# EAGLE design Stellaris Guru PCBv1 (EAGLE 5.07)
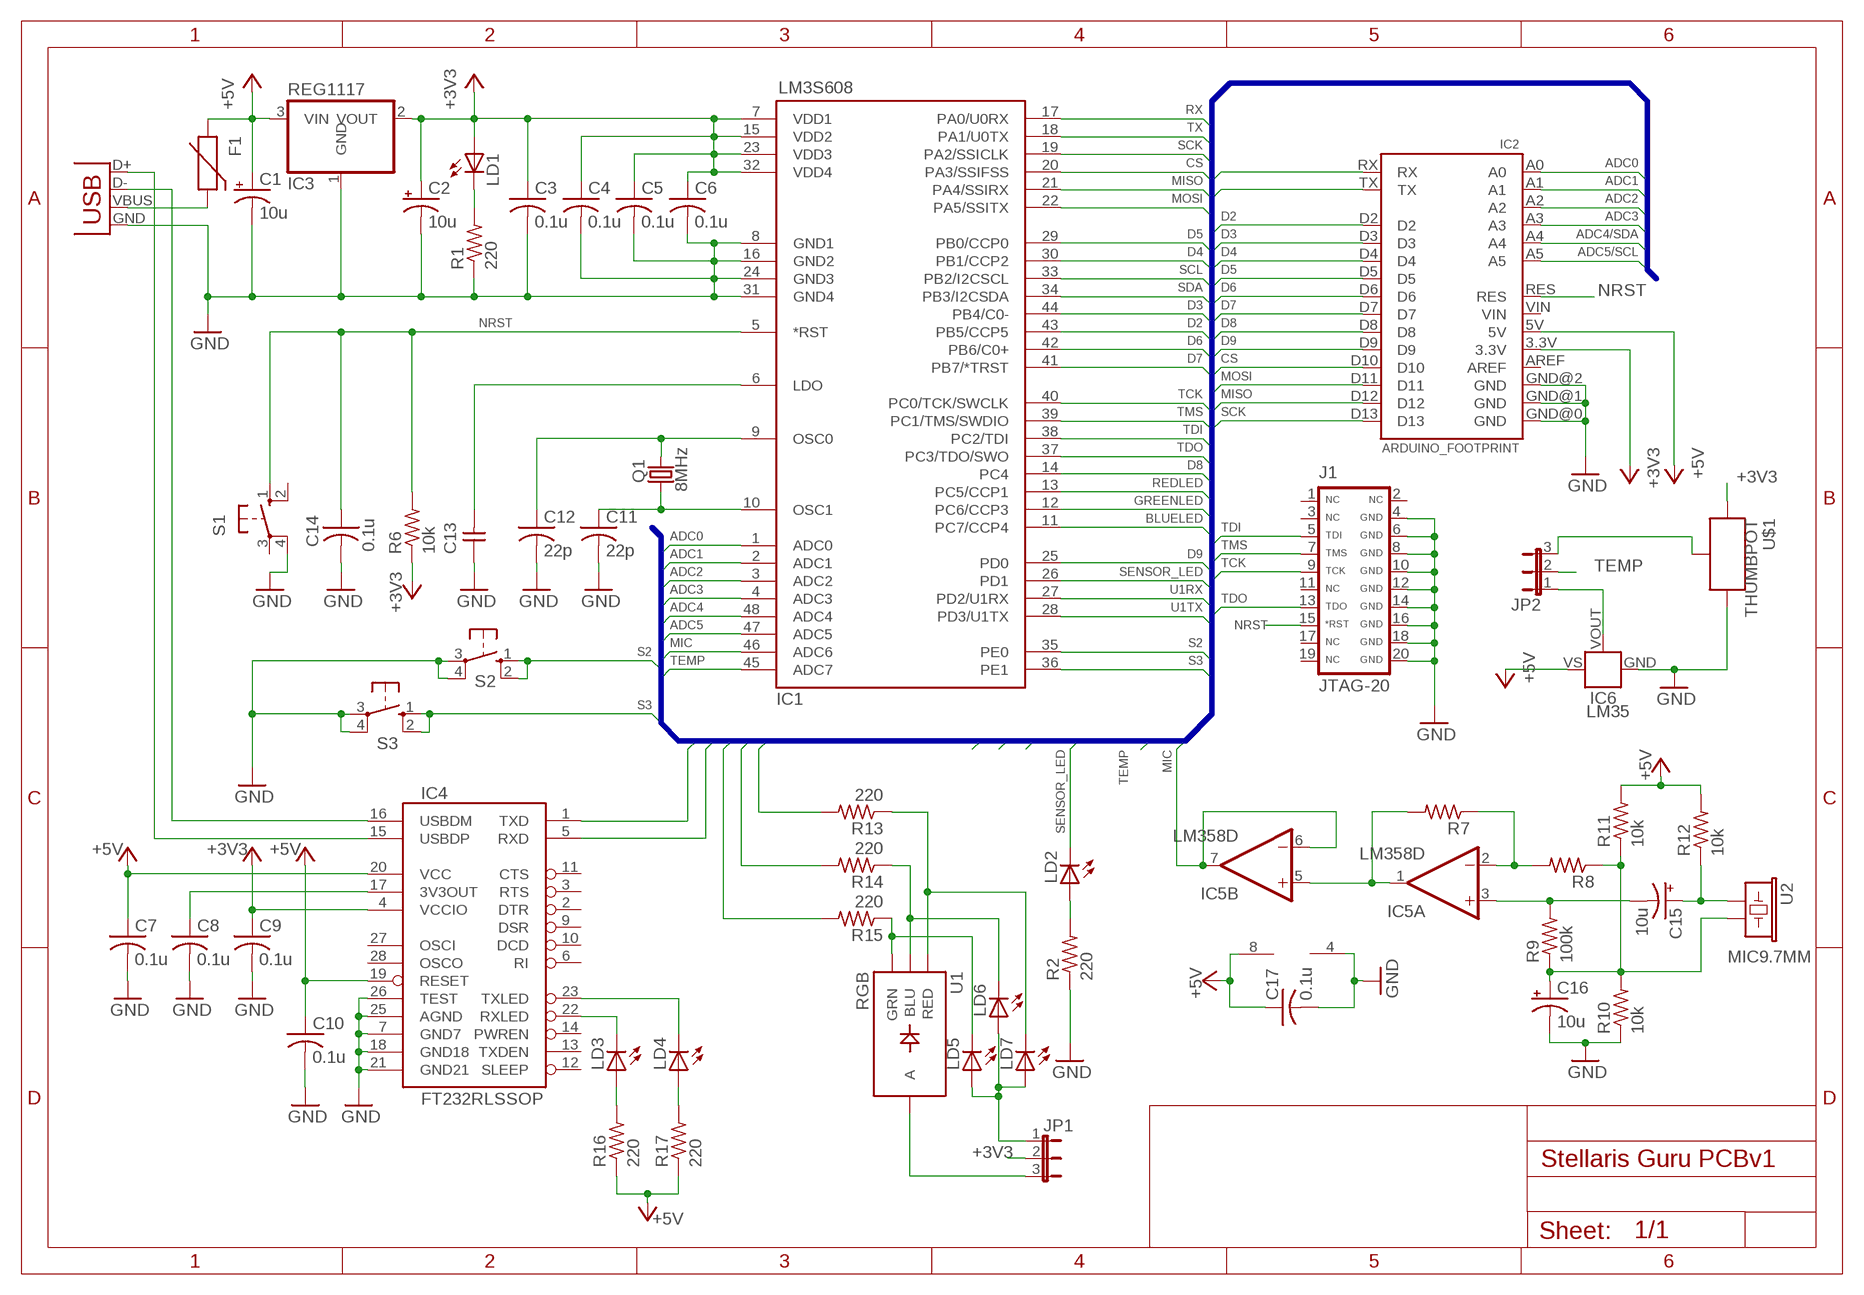
[diagram p0: schematic, sheet 1]

## Parts
C1  10u  CAP_POL_16V  [B/3528-21R]
C2  10u  CAP_POL_16V  [B/3528-21R]
C3  0.1u  CAP0805  [C0805]
C4  0.1u  CAP0805  [C0805]
C5  0.1u  CAP0805  [C0805]
C6  0.1u  CAP0805  [C0805]
C7  0.1u  CAP0805  [C0805]
C8  0.1u  CAP0805  [C0805]
C9  0.1u  CAP0805  [C0805]
C10  0.1u  CAP0805  [C0805]
C11  22p  CAP0805  [C0805]
C12  22p  CAP0805  [C0805]
C13  UNPOLARIZED_CAPACITOR1206  [1206]
C14  0.1u  CAP0805  [C0805]
C15  10u  CAP_POL_16V  [B/3528-21R]
C16  10u  CAP_POL_16V  [B/3528-21R]
C17  0.1u  CAP0805  [C0805]
F1  PTCSMD  [PTC-1206]
IC1  LM3S608  [LQFP48]
IC2  ARDUINO_FOOTPRINT  [ARDUINO_FOOTPRINT]
IC3  REG1117  [SOT223]
IC4  FT232RLSSOP  [SSOP28DB]
IC5  LM358D  [SO08]
IC6  LM35  LM35TO-92  [TO92]
J1  JTAG-20  [JTAG-20]
JP1  JP2W  [JP2W]
JP2  JP2W  [JP2W]
LD1  LED0805  [CHIPLED_0805]
LD2  LED0805  [CHIPLED_0805]
LD3  LED0805  [CHIPLED_0805]
LD4  LED0805  [CHIPLED_0805]
LD5  LED0805  [CHIPLED_0805]
LD6  LED0805  [CHIPLED_0805]
LD7  LED0805  [CHIPLED_0805]
Q1  8MHz  CRYSTALHC49US  [HC49US]
R1  220  RESISTOR0805  [R0805]
R2  220  RESISTOR0805  [R0805]
R6  10k  RESISTOR0805  [R0805]
R7  RESISTOR0805  [R0805]
R8  RESISTOR0805  [R0805]
R9  100k  RESISTOR0805  [R0805]
R10  10k  RESISTOR0805  [R0805]
R11  10k  RESISTOR0805  [R0805]
R12  10k  RESISTOR0805  [R0805]
R13  220  RESISTOR0805  [R0805]
R14  220  RESISTOR0805  [R0805]
R15  220  RESISTOR0805  [R0805]
R16  220  RESISTOR0805  [R0805]
R17  220  RESISTOR0805  [R0805]
S1  10-XX  [B3F-10XX]
S2  10-XX  [B3F-10XX]
S3  10-XX  [B3F-10XX]
U1  RGB  LED-TRICOLOR  [LED-TRICOLOR-SMD]
U2  MIC9.7MM  [MIC-9.7MM]
U$1  THUMBPOT  [THUMBPOT]
X1  USBSMD  [USB-MINIB]

## Nets
+3V3 [+3V3]: C2.+ C3.1 C4.1 C5.1 C6.1 C9.1 IC1.7(VDD1) IC1.15(VDD2) IC1.23(VDD3) IC1.32(VDD4) IC2.3.3V IC3.2(VOUT) IC4.4(VCCIO) JP1.2 LD1.A R6.1 U$1.1(E)
+5V [power]: C1.+ C7.1 C10.1 C17.1 F1.1 IC2.5V IC3.3(VIN) IC4.19(RESET) IC4.20(VCC) IC5.8(P:V+) IC6.VS R11.2 R12.2 R16.1 R17.1
ADC0: IC1.1(ADC0) IC2.A0
ADC1: IC1.2(ADC1) IC2.A1
ADC2: IC1.3(ADC2) IC2.A2
ADC3: IC1.4(ADC3) IC2.A3
ADC4: IC1.34(PB3/I2CSDA) IC1.48(ADC4) IC2.A4
ADC5: IC1.33(PB2/I2CSCL) IC1.47(ADC5) IC2.A5
BLUELED: IC1.11(PC7/CCP4) R15.2
CS: IC1.20(PA3/SSIFSS) IC2.D10
D2: IC1.43(PB5/CCP5) IC2.D2
D3: IC1.44(PB4/C0-) IC2.D3
D4: IC1.30(PB1/CCP2) IC2.D4
D5: IC1.29(PB0/CCP0) IC2.D5
D6: IC1.42(PB6/C0+) IC2.D6
D7: IC1.41(PB7/*TRST) IC2.D7
D8: IC1.14(PC4) IC2.D8
D9: IC1.25(PD0) IC2.D9
GND [GND]: C1.- C2.- C3.2 C4.2 C5.2 C6.2 C7.2 C8.2 C9.2 C10.2 C11.2 C12.2 C13.1 C14.2 C16.- C17.2 IC1.8(GND1) IC1.16(GND2) IC1.24(GND3) IC1.31(GND4) IC2.GND@0(GND) IC2.GND@1(GND) IC2.GND@2(GND) IC3.1(GND) IC4.7(GND7) IC4.18(GND18) IC4.21(GND21) IC4.25(AGND) IC4.26(TEST) IC5.4(P:V-) IC6.GND J1.4(GND) J1.6(GND) J1.8(GND) J1.10(GND) J1.12(GND) J1.14(GND) J1.16(GND) J1.18(GND) J1.20(GND) R1.1 R2.1 R10.1 S1.4(P1) S2.3(P) S2.4(P1) S3.3(P) S3.4(P1) U$1.3(A) X1.GND
GREENLED: IC1.12(PC6/CCP3) R14.2
MIC: IC1.46(ADC6) IC5.6(B:-IN) IC5.7(B:OUT)
MISO: IC1.21(PA4/SSIRX) IC2.D12
MOSI: IC1.22(PA5/SSITX) IC2.D11
N$1: IC4.22(RXLED) LD3.C
N$2: IC4.16(USBDM) X1.D-
N$3: LD1.C R1.2
N$4: IC4.15(USBDP) X1.D+
N$5: C8.1 IC4.17(3V3OUT)
N$6: IC4.23(TXLED) LD4.C
N$7: LD4.A R17.2
N$8: LD3.A R16.2
N$11: C12.1 IC1.9(OSC0) Q1.2
N$12: C11.1 IC1.10(OSC1) Q1.1
N$13: C13.2 IC1.6(LDO)
N$16: LD2.A R2.2
N$18: IC5.1(A:OUT) IC5.5(B:+IN) R7.2
N$19: IC5.2(A:-IN) R7.1 R8.2
N$20: C15.+ R12.1 U2.1
N$21: C16.+ R8.1 R9.1 R10.2 R11.1 U2.2
N$22: C15.- IC5.3(A:+IN) R9.2
N$23: LD7.C R13.1 U1.R(RED)
N$25: LD6.C R14.1 U1.B(BLU)
N$27: LD5.C R15.1 U1.G(GRN)
N$28 [power]: F1.2 X1.VBUS
N$33: IC6.VOUT JP2.1
N$34: JP2.3 U$1.2(S)
N$35 [power]: JP1.1 LD5.A LD6.A LD7.A
N$36 [power]: JP1.3 U1.A
NRST: C14.1 IC1.5(*RST) IC2.RES J1.15(RST) R6.2 S1.1(S)
REDLED: IC1.13(PC5/CCP1) R13.2
RX: IC1.17(PA0/U0RX) IC4.1(TXD)
S2: IC1.35(PE0) S2.1(S) S2.2(S1)
S3: IC1.36(PE1) S3.1(S) S3.2(S1)
SCK: IC1.19(PA2/SSICLK) IC2.D13
SENSOR_LED: IC1.26(PD1) LD2.C
TCK: IC1.40(PC0/TCK/SWCLK) J1.9(TCK)
TDI: IC1.38(PC2/TDI) J1.5(TDI)
TDO: IC1.37(PC3/TDO/SWO) J1.13(TDO)
TEMP: IC1.45(ADC7) JP2.2
TMS: IC1.39(PC1/TMS/SWDIO) J1.7(TMS)
TX: IC1.18(PA1/U0TX) IC4.5(RXD)
U1RX: IC1.27(PD2/U1RX) IC2.RX
U1TX: IC1.28(PD3/U1TX) IC2.TX
Unconnected: IC2.AREF IC2.VIN IC4.2(DTR) IC4.3(RTS) IC4.6(RI) IC4.9(DSR) IC4.10(DCD) IC4.11(CTS) IC4.12(SLEEP) IC4.13(TXDEN) IC4.14(PWREN) IC4.27(OSCI) IC4.28(OSCO) J1.1(VREF) J1.2(VTAR) J1.3(NTRST) J1.11(RTCK) J1.17(OBGRQ) J1.19(OBGACK) S1.2(S1) S1.3(P)

## Buses
ADC0,ADC1,ADC2,ADC3,ADC4,ADC5,MISO,MOSI,CS,SCK,RX,TX,D2,D3,D4,D5,D6,D7,D8,D9,U1RX,U1TX,TCK,TMS,TDI,TDO,SENSOR_LED,REDLED,GREENLED,BLUELED,S2,S3,MIC,TEMP

## Notes on the sheet
- ADC4/SDA
- ADC5/SCL
- SCL
- SDA

## Library data of the parts
C1 C2 C15 C16 = CEDTv50:CAP_POL
C3-C12 C14 C17 = CEDTv56:CAP
C13 = ng:UNPOLARIZED_CAPACITOR: unpolarized_capacitor
F1 = CEDTv56:PTC: Resettable Fuse PTC Resettable Fuse. Spark Fun Electronics SKU : COM-08357
IC1 = CEDTv50:LM3S608
IC2 = CEDTv50:ARDUINO_FOOTPRINT: Standard footprint of the Arduino Board.
IC3 = CEDTv50:REG1117: 800mA and 1A Low Dropout (LDO) Positive Regulator 1.8V, 2.5V, 2.85V, 3.3V, 5V, and Adj
IC4 = CEDTv56:FT232RL: USB UART FT232RL 4th Generation USB UART (USB <-> Serial) Controller. Spark Fun Electronics SKU : COM-00650
IC5 = linear:LM358: OP AMP also LM158; LM258; LM2904 Source: http://cache.national.com/ds/LM/LM158.pdf
IC6 = CEDTv50:LM35TO-92
J1 = CEDTv50:JTAG-20: JTAG 20-Pin Programming/Debug Connector
JP1 JP2 = jumper:JP2W: JUMPER
LD1-LD7 = CEDTv56:LED
Q1 = CEDTv56:CRYSTAL: Crystals Various standard crystals. Proven footprints. Spark Fun Electronics SKU : COM-00534
R1 R2 R6-R17 = CEDTv56:RESISTOR
S1-S3 = CEDTv50:10-XX: OMRON SWITCH
U1 = SparkFun:LED-TRICOLOR: Tri-Color LED SMD Proven layout and schematic for triple color LED in SMD package - common anode. Spark Fun Electronics SKU : COM-07844
U2 = CEDTv56:MIC: Microphone Omni-directional electret microphone. 9.7mm standard diameter.
U$1 = CEDTv52:THUMBPOT
X1 = CEDTv56:USB: USB Connectors USB-B-PTH is fully proven SKU : PRT-00139 USB-miniB is fully proven SKU : PRT-00587 USB-A-PCB is untested. USB-A-H is throughly reviewed, but untested. Spark Fun Electronics SKU : PRT-00437 USB-B-SMT is throughly reviewed, but untested. Needs silkscreen touching up. USB-A-S has not been used/tested USB-MB-H has not been used/tested

## Net classes
0 default: width 0.241 mm, clearance 0.127 mm
1 power: width 0.508 mm
2 +3V3: width 0.508 mm
3 GND: width 0.508 mm

## Board
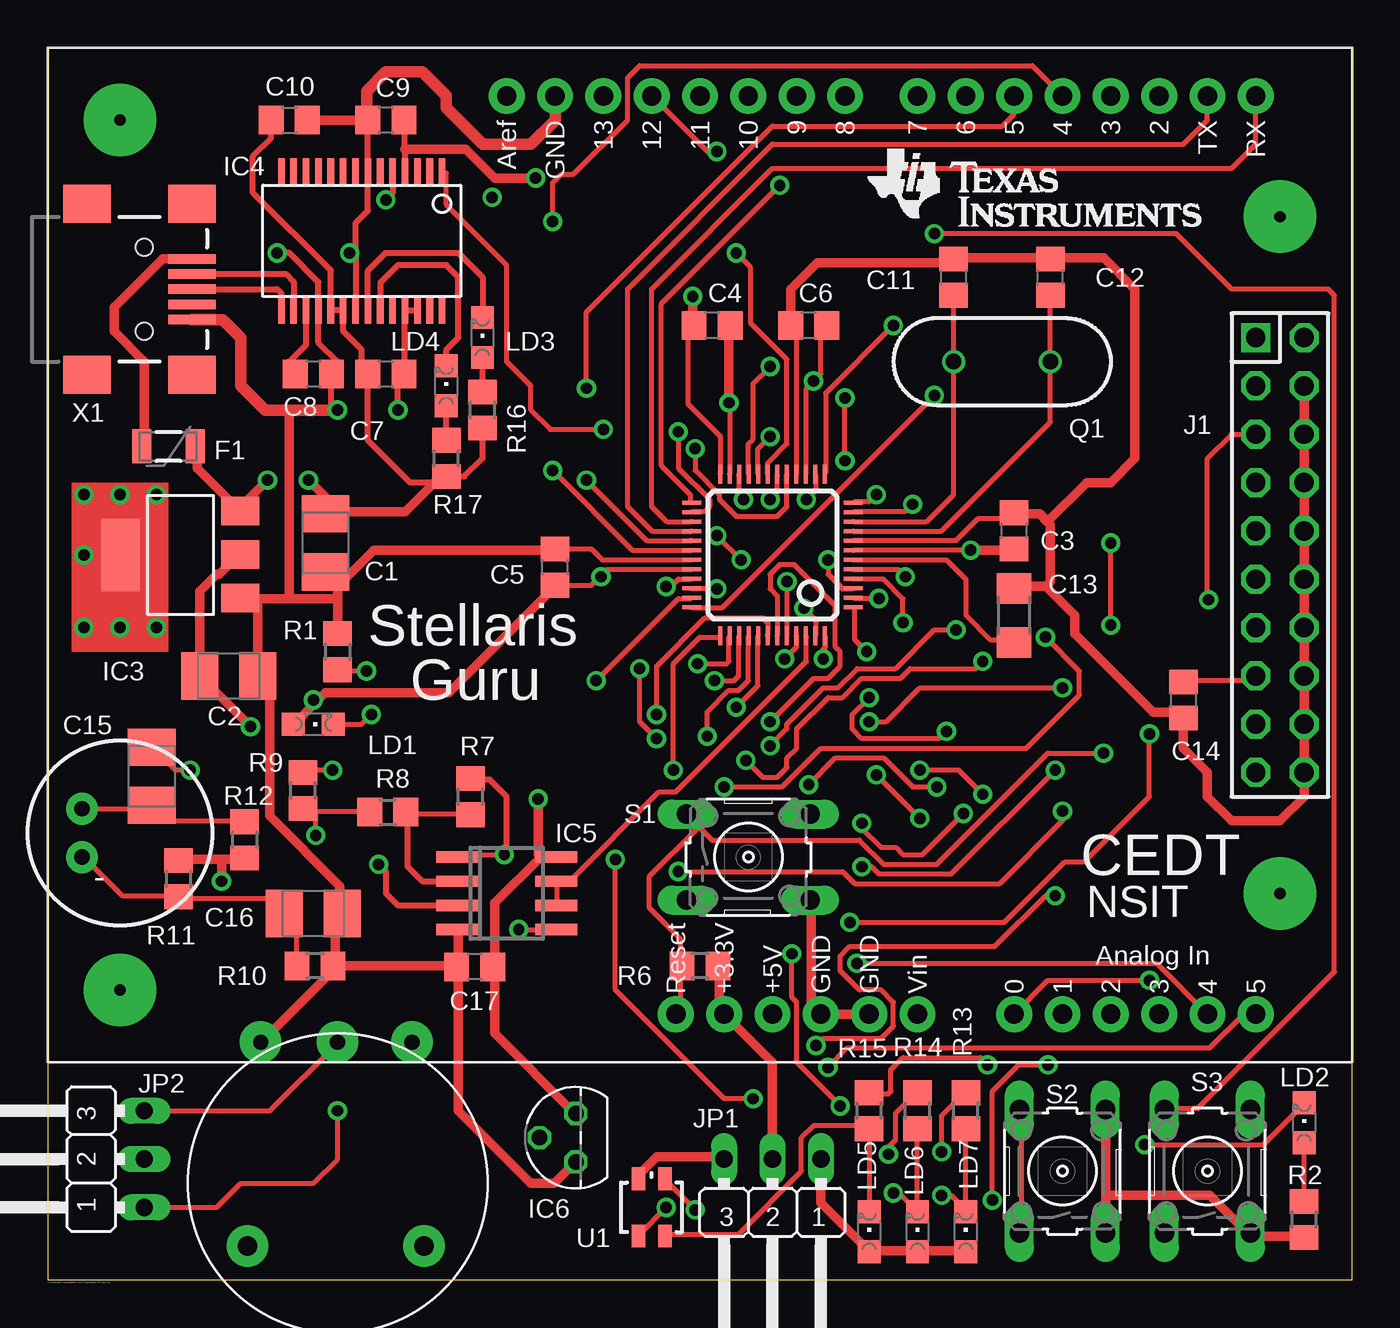
[diagram p1: board, top side]
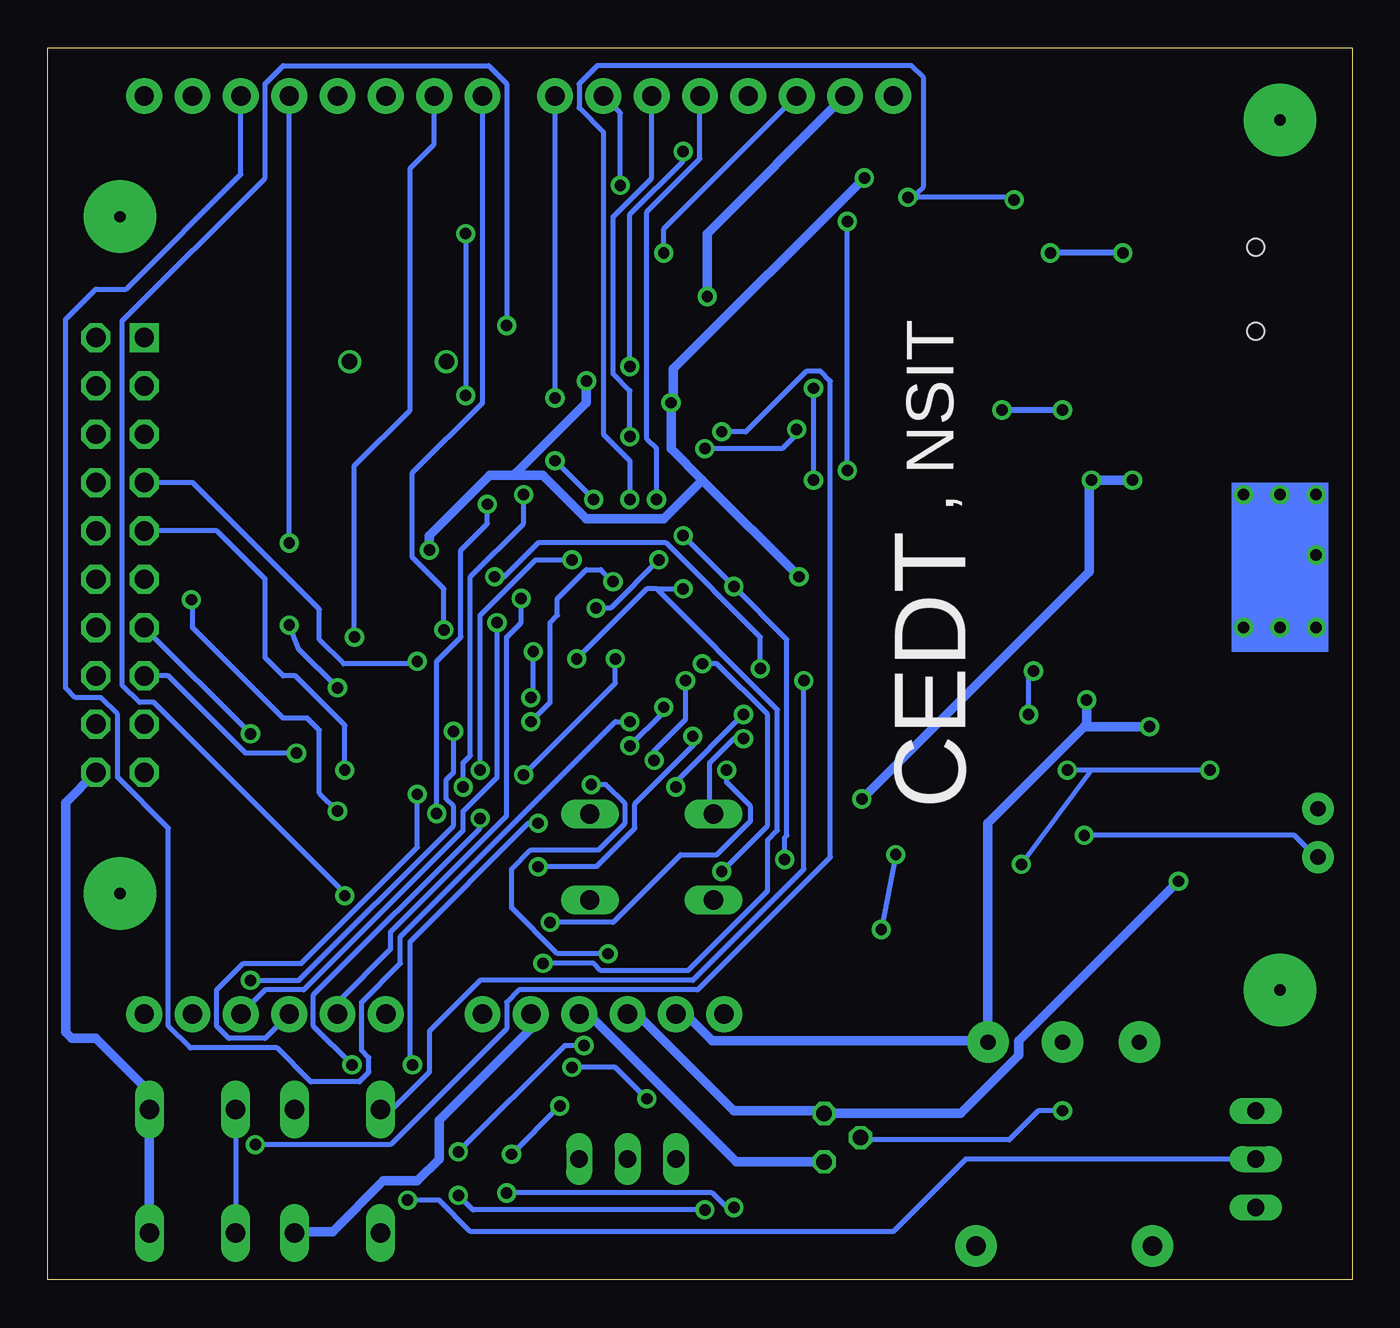
[diagram p2: board, bottom side, seen from below]

Size 68.58 x 64.77 mm. Coordinates in mm from the lower left corner, seen from the top.
Outline: 68.56,0 0,0 0,64.77 68.58,64.77 68.58,0
Copper layers (1*16): Top 0.035mm / dielectric 1.5mm / Bottom 0.035mm
Design rules "default *": minimum track width 10mil, minimum drill 0.6mm, track to track 8mil, track to pad 8mil, pad to pad 8mil, via to via 8mil, smd to smd 8mil, copper to edge 40mil, drill to drill 10mil, minimum pad ring 8mil, minimum via ring 8mil, stop-mask expansion 4mil, vias tented up to drill 0mil, thermal gap 10mil

### Footprints (pad centres in the part's own frame; a part is rotated, then mirrored left to right if it is on the bottom)
B/3528-21R = smd 1.95 x 2.5: + 1.525,0; - -1.525,0
C0805 = smd 1.3 x 1.5: 1 -0.95,0; 2 0.95,0
1206 = smd 1.6 x 1.803: 1 -1.422,0; 2 1.422,0
PTC-1206 = smd 1 x 1.8: 1 -1.4,0; 2 1.4,0
LQFP48 = smd 1 x 0.2: 1 -4.25,2.75; 2 -4.25,2.25; 3 -4.25,1.75; 4 -4.25,1.25; 5 -4.25,0.75; 6 -4.25,0.25; 7 -4.25,-0.25; 8 -4.25,-0.75; 9 -4.25,-1.25; 10 -4.25,-1.75; 11 -4.25,-2.25; 12 -4.25,-2.75; 25 4.25,-2.75; 26 4.25,-2.25; 27 4.25,-1.75; 28 4.25,-1.25; 29 4.25,-0.75; 30 4.25,-0.25; 31 4.25,0.25; 32 4.25,0.75; 33 4.25,1.25; 34 4.25,1.75; 35 4.25,2.25; 36 4.25,2.75 | smd 0.2 x 1: 13 -2.75,-4.25; 14 -2.25,-4.25; 15 -1.75,-4.25; 16 -1.25,-4.25; 17 -0.75,-4.25; 18 -0.25,-4.25; 19 0.25,-4.25; 20 0.75,-4.25; 21 1.25,-4.25; 22 1.75,-4.25; 23 2.25,-4.25; 24 2.75,-4.25; 37 2.75,4.25; 38 2.25,4.25; 39 1.75,4.25; 40 1.25,4.25; 41 0.75,4.25; 42 0.25,4.25; 43 -0.25,4.25; 44 -0.75,4.25; 45 -1.25,4.25; 46 -1.75,4.25; 47 -2.25,4.25; 48 -2.75,4.25
ARDUINO_FOOTPRINT = drill 1.016 pad 1.88 round: 3.3V 35.56,2.54; 5V 38.1,2.54; A0 50.8,2.54; A1 53.34,2.54; A2 55.88,2.54; A3 58.42,2.54; A4 60.96,2.54; A5 63.5,2.54; AREF 24.13,50.8; D2 58.42,50.8; D3 55.88,50.8; D4 53.34,50.8; D5 50.8,50.8; D6 48.26,50.8; D7 45.72,50.8; D8 41.91,50.8; D9 39.37,50.8; D10 36.83,50.8; D11 34.29,50.8; D12 31.75,50.8; D13 29.21,50.8; GND@0 40.64,2.54; GND@1 43.18,2.54; GND@2 26.67,50.8; RES 33.02,2.54; RX 63.5,50.8; TX 60.96,50.8; VIN 45.72,2.54
SOT223 = smd 1.499 x 2.007: 1 -2.261,-3.15; 2 0.025,-3.15; 3 2.311,-3.15 | smd 3.81 x 2.007: 4 0,3.15
SSOP28DB = smd 0.348 x 1.397: 1 -4.225,-3.656; 2 -3.575,-3.656; 3 -2.925,-3.656; 4 -2.275,-3.656; 5 -1.625,-3.656; 6 -0.975,-3.656; 7 -0.325,-3.656; 8 0.325,-3.656; 9 0.975,-3.656; 10 1.625,-3.656; 11 2.275,-3.656; 12 2.925,-3.656; 13 3.575,-3.656; 14 4.225,-3.656; 15 4.225,3.656; 16 3.575,3.656; 17 2.925,3.656; 18 2.275,3.656; 19 1.625,3.656; 20 0.975,3.656; 21 0.325,3.656; 22 -0.325,3.656; 23 -0.975,3.656; 24 -1.625,3.656; 25 -2.275,3.656; 26 -2.925,3.656; 27 -3.575,3.656; 28 -4.225,3.656
SO08 = smd 0.6 x 2.2: 1 -1.905,-2.6; 2 -0.635,-2.6; 3 0.635,-2.6; 4 1.905,-2.6; 5 1.905,2.6; 6 0.635,2.6; 7 -0.635,2.6; 8 -1.905,2.6
TO92 = drill 0.813 octagon: GND -1.27,0; VOUT 0,1.905; VS 1.27,0
JTAG-20 = drill 1.016 square: 1 -11.43,-1.27 | drill 1.016 octagon: 2 -11.43,1.27; 3 -8.89,-1.27; 4 -8.89,1.27; 5 -6.35,-1.27; 6 -6.35,1.27; 7 -3.81,-1.27; 8 -3.81,1.27; 9 -1.27,-1.27; 10 -1.27,1.27; 11 1.27,-1.27; 12 1.27,1.27; 13 3.81,-1.27; 14 3.81,1.27; 15 6.35,-1.27; 16 6.35,1.27; 17 8.89,-1.27; 18 8.89,1.27; 19 11.43,-1.27; 20 11.43,1.27
JP2W = drill 0.914 long: 1 -2.54,-1.27; 2 0,-1.27; 3 2.54,-1.27
CHIPLED_0805 = smd 1.2 x 1.2: A 0,-1.05; C 0,1.05
HC49US = drill 0.813 round: 1 -2.54,0; 2 2.54,0
R0805 = smd 1.3 x 1.5: 1 -0.95,0; 2 0.95,0
B3F-10XX = drill 1.016 long: 1 -3.251,2.261; 2 3.251,2.261; 3 -3.251,-2.261; 4 3.251,-2.261
LED-TRICOLOR-SMD = smd 0.7 x 1.2: A 0.7,-1.5; B 0.7,1.5; G -0.7,1.5; R -0.7,-1.5
MIC-9.7MM = drill 0.8 pad 1.676 round: 1 -2,1.27; 2 -2,-1.27
THUMBPOT = drill 0.8 pad 2.184 round: 1 -3.912,-7.417; 2 0,-7.417; 3 4.039,-7.417 | drill 1.016 pad 2.184 round: P$4 4.724,3.302; P$5 -4.547,3.302
USB-MINIB = smd 2.5 x 0.5: D+ 2.5,0; D- 2.5,0.8; GND 2.5,-1.6; ID 2.5,-0.8; VBUS 2.5,1.6 | smd 2.5 x 2: GND@1 -3,-4.5; GND@2 -3,4.5; GND@3 2.5,4.5; GND@4 2.5,-4.5 | hole 0.9: 0,2.2; 0,-2.2

### Placement (x,y rotation side)
C1  14.61,38.73 90 top
C2  9.53,31.75 180 top
C3  50.8,39.37 90 top
C4  34.92,50.16 180 top
C5  26.67,37.47 90 top
C6  40.01,50.16 180 top
C7  17.78,47.62 0 top
C8  13.97,47.62 0 top
C9  17.78,60.96 180 top
C10  12.7,60.96 0 top
C11  47.62,52.7 90 top
C12  52.7,52.7 90 top
C13  50.8,34.92 270 top
C14  59.69,30.48 270 top
C15  5.48,26.47 270 top
C16  13.97,19.27 180 top
C17  22.45,16.46 180 top
F1  6.35,43.81 180 top
IC1  38.1,38.1 180 top
IC2  0,11.43 0 top
IC3  6.99,38.1 90 top
IC4  16.51,54.61 180 top
IC5  24.13,20.32 270 top
IC6  27.76,7.48 90 top
J1  64.77,38.1 270 top
JP1  38.1,5.08 180 top
JP2  3.81,6.35 90 top
LD1  13.97,29.21 270 top
LD2  66.04,8.26 0 top
LD3  22.86,49.53 0 top
LD4  20.95,46.99 0 top
LD5  43.18,2.54 0 top
LD6  45.72,2.54 0 top
LD7  48.26,2.54 0 top
Q1  50.16,48.26 0 top
R1  15.24,33.02 270 top
R2  66.04,3.17 90 top
R6  34.29,16.51 180 top
R7  22.23,25.4 90 top
R8  17.88,24.58 0 top
R9  13.42,25.72 90 top
R10  14.05,16.51 180 top
R11  6.89,21.09 90 top
R12  10.35,23.13 270 top
R13  48.26,8.89 90 top
R14  45.72,8.89 90 top
R15  43.18,8.89 90 top
R16  22.86,45.72 90 top
R17  20.95,43.18 90 top
S1  36.83,22.23 0 top
S2  53.34,5.71 90 top
S3  60.96,5.71 90 top
U1  31.75,3.81 180 top
U2  3.81,23.5 0 top
U$1  15.24,5.08 180 top
X1  5.08,52.07 0 top

### Tracks (layer width: path | path; a pad name or v marks a point on that pad's centre or on a via)
+3V3  (via drill 0.6)
  Top 0.254: 26.98,36.83 C5.1 28.57,36.51 29.05,36.99 29.41,37.35 IC1.32 | C6.1 40.64,49.85 40.64,47.62 v40.26,47.24 39.85,46.84 IC1.15 | IC1.7 v48.51,38.35 | IC1.23 35.85,46.06 v35.81,46.1
  Top 0.305: IC4.4 18.79,59.44 18.79,60.91 C9.1
  Top 0.508: R6.1 35.31,16.51 35.31,14.22 IC2.3.3V 38.1,11.43 JP1.2 | IC3.2 10.03,38.1 9.02,37.08 8.89,37.08 8,36.2 C2.+ 8.13,31.62 v10.67,29.08 | 14.1,30.35 14.61,30.86 21.08,30.86 26.67,36.45 C5.1 | 14.1,30.35 12.95,29.21 LD1.A | v35.81,46.1 35.81,50.16 C4.1 | 29.05,36.99 v29.08,36.96 | v48.51,38.35 50.8,38.35 C3.1 | v25.65,57.91 23.5,57.91 21.97,59.44 18.79,59.44 | v13.97,30.48 14.1,30.35
  Bottom 0.508: U$1.1 19.18,12.57 | IC2.3.3V 35.05,13.97 33.66,12.57 19.43,12.57 U$1.1 | 13.97,29.08 14.1,29.08 19.18,24 19.18,12.83 U$1.1 | 13.97,29.08 v10.67,29.08 | v29.08,36.96 34.16,42.04 | 34.16,42.04 35.81,43.69 v35.81,46.1 35.69,46.23 35.69,47.88 v25.65,57.91 | v48.51,38.35 48.51,39.12 45.34,42.29 43.94,42.29 | 43.94,42.29 42.55,42.29 40.26,40.01 36.2,40.01 34.16,42.04 | 43.94,42.29 43.94,42.42 40.26,46.1 v40.26,47.24 | 13.97,29.08 v13.97,30.48
+5V  (via drill 0.6)
  Top 0.305: C10.1 11.75,60.01 10.79,59.05 10.79,57.15 14.88,53.06 IC4.19 IC4.20 15.54,49.87 16.51,48.9 16.51,47.95 C7.1 16.83,44.13 19.05,41.91 20.32,41.91 20.64,41.91 R17.1 21.91,42.23 22.86,43.18 R16.1
  Top 0.508: F1.1 7.87,43.81 7.87,42.67 IC3.3 10.16,40.64 v11.56,42.04 | v13.72,42.04 14.86,40.89 C1.+ 14.61,40.39 18.8,40.39 20.32,41.91 | 9.14,22.1 10.29,22.1 R12.2 | 9.14,22.1 6.99,22.1 R11.2 | 9.14,22.1 v9.14,20.95 | IC6.VS 27.69,8.76 23.5,12.95 23.5,16.26 C17.1 23.5,16.51 23.5,19.81 25.91,22.23 IC5.8 25.78,22.35 v25.78,25.27
  Bottom 0.508: v11.56,42.04 v13.72,42.04 13.84,41.91 13.84,37.21 v25.78,25.27 | v9.14,20.95 17.53,12.57 17.53,11.81 20.57,8.76 27.69,8.76 IC6.VS 27.94,8.89 32.51,8.89 37.59,13.97 IC2.5V
ADC0  (via drill 0.6)
  Top 0.254: v43.05,33.02 42.42,33.66 42.42,35.31 IC1.1 | v43.18,30.61 42.29,29.72 42.29,28.96 42.8,28.45 46.86,28.45 v47.24,28.83 | v57.91,15.75 52.58,15.75 IC2.A0
  Bottom 0.254: v43.05,33.02 43.05,30.73 v43.18,30.61 | v47.24,28.83 47.24,26.67 47.62,26.29 47.62,25.27 47.24,24.89 47.24,23.88 55.37,15.75 v57.91,15.75
ADC1  (via drill 0.6)
  Top 0.254: v43.69,35.81 42.42,35.81 IC1.2
  Bottom 0.254: v43.69,35.81 43.69,34.54 44.45,33.78 44.45,24.38 50.55,18.29 50.55,17.4 53.34,14.61 IC2.A1
ADC2  (via drill 0.6)
  Top 0.254: v41.02,37.85 41.02,37.08 41.78,36.32 42.29,36.32 IC1.3 | v45.85,26.8 47.88,26.8 v49.15,25.53
  Bottom 0.254: v41.02,37.85 42.93,37.85 45.85,34.92 v45.85,26.8 | v49.15,25.53 49.15,22.73 55.24,16.64 58.29,16.64 59.69,15.24 59.69,13.34 59.05,12.7 57.15,12.7 IC2.A2
ADC3  (via drill 0.6)
  Top 0.254: v44.96,34.54 44.96,35.81 43.94,36.83 42.42,36.83 IC1.4
  Bottom 0.254: v44.96,34.54 44.96,26.42 46.74,24.64 46.74,23.62 55.12,15.24 57.15,15.24 IC2.A3
ADC4  (via drill 0.6)
  Top 0.254: v35.18,36.32 33.91,36.32 IC1.34 | v40.77,32.64 40.77,33.15 40.89,33.27 40.89,33.78 IC1.48 | IC2.A4 58.29,16.64 v42.55,16.64
  Bottom 0.254: 36.58,36.32 37.08,36.32 v40.77,32.64 | 36.58,36.32 v35.18,36.32 | v42.55,16.64 39.88,16.64 39.5,16.26 34.92,16.26 30.73,20.45 30.73,23.11 30.23,23.62 30.23,29.97 36.58,36.32
ADC5  (via drill 0.6)
  Top 0.254: v39.75,35.31 40.39,34.67 40.39,33.91 IC1.47 | v35.18,39.12 v36.45,37.85 | v32.51,36.45 32.77,36.45 33.15,36.83 33.78,36.83 IC1.33 | IC2.A5 62.87,13.97 61.09,12.19 42.04,12.19 v41.02,11.18 | v37.08,9.53 35.56,9.53 29.84,15.24 v29.84,22.1
  Bottom 0.254: v39.75,35.31 38.99,35.31 v36.45,37.85 | v35.18,39.12 v32.51,36.45 29.72,33.66 29.72,23.37 29.84,23.24 v29.84,22.1 | v41.02,11.18 38.73,11.18 v37.08,9.53
BLUELED  (via drill 0.6)
  Top 0.254: v49.4,11.3 49.02,11.68 44.96,11.68 44.32,11.05 44.32,9.91 44.2,9.78 43.18,9.78 R15.2 | v42.8,24 42.8,23.75 43.81,22.73 44.58,22.73 44.96,22.35 45.97,22.35 v48.13,24.51 | v45.47,40.77 45.09,40.39 42.42,40.39 IC1.11
  Bottom 0.254: v49.4,11.3 49.53,11.43 49.53,17.78 43.31,24 v42.8,24 | v48.13,24.51 48.13,32.51 46.86,33.78 46.86,38.35 45.47,39.75 v45.47,40.77
CS  (via drill 0.6)
  Top 0.254: v37.97,44.32 37.34,43.69 37.34,42.42 IC1.20
  Bottom 0.254: v37.97,44.32 37.97,46.74 38.86,47.62 38.86,55.88 36.83,57.91 IC2.D10
D2  (via drill 0.6)
  Top 0.254: v37.97,29.34 40.26,31.62 41.02,31.62 41.66,32.26 41.66,33.02 41.4,33.27 41.4,35.43 39.24,37.59 38.48,37.59 37.97,37.08 37.97,36.32 38.35,35.94 38.35,33.91 IC1.43
  Bottom 0.254: v37.97,29.34 38.73,29.34 50.04,18.03 50.04,16.64 52.07,14.61 52.07,12.06 51.69,11.68 51.69,10.92 52.2,10.41 54.74,10.41 56.52,12.19 61.09,12.19 62.23,13.34 62.23,23.75 64.9,26.42 64.9,29.72 65.79,30.61 67.12,30.61 67.63,31.11 67.63,50.48 66.04,52.07 64.45,52.07 58.42,58.1 IC2.D2
D3  (via drill 0.6)
  Top 0.254: v38.86,36.7 38.86,33.91 IC1.44 | v43.18,29.34 44.07,29.34 45.85,31.11 v53.34,31.11 | v55.88,34.42 v55.88,38.73
  Bottom 0.254: v38.86,36.7 39.5,37.34 40.26,37.34 41.78,35.81 41.78,34.92 42.16,34.54 42.16,30.35 v43.18,29.34 | v53.34,31.11 55.37,33.15 v55.88,34.42 | v55.88,38.73 IC2.D3
D4  (via drill 0.6)
  Top 0.254: v26.54,55.63 26.54,57.66 26.99,58.1 27.62,58.1 30.48,60.96 30.48,63.18 31.11,63.82 51.75,63.82 IC2.D4 | IC1.30 30.74,38.35 v26.54,42.55
  Bottom 0.254: v26.54,42.55 v26.54,55.63
D5  (via drill 0.6)
  Top 0.254: v28.32,42.04 31.5,38.86 33.78,38.86 IC1.29 | IC2.D5 50.8,61.28 50.16,60.64 38.1,60.64 28.32,50.86 v28.32,46.86
  Bottom 0.254: v28.32,42.04 v28.32,46.86
D6  (via drill 0.6)
  Top 0.254: v32,29.72 32,32.26 34.54,34.8 37.59,34.8 37.85,34.54 37.85,33.91 IC1.42 | v35.56,25.91 38.61,25.91 40.64,27.94 51.44,27.94 54.23,30.73 54.23,32 v52.45,33.78
  Bottom 0.254: v32,29.72 35.56,26.16 v35.56,25.91 | IC2.D6 48.26,59.69 49.53,58.42 49.53,45.72 52.45,42.8 v52.45,33.78
D7  (via drill 0.6)
  Top 0.254: v36.2,30.1 37.34,31.24 37.34,33.78 IC1.41 | v37.97,28.07 38.86,28.96 38.86,29.21 40.77,31.11 41.53,31.11 42.55,32.13 44.58,32.13 46.61,34.16 v47.75,34.16
  Bottom 0.254: v36.2,30.1 36.2,29.84 v37.97,28.07 | v47.75,34.16 47.75,36.32 49.4,37.97 49.4,42.42 45.72,46.1 IC2.D7
D8  (via drill 0.6)
  Top 0.254: v39.88,41.02 40.39,41.53 40.39,42.29 IC1.14 | v41.91,43.05 v41.91,46.35
  Bottom 0.254: v39.88,41.02 v41.91,43.05 | v41.91,46.35 IC2.D8
D9  (via drill 0.6)
  Top 0.254: v38.48,57.53 32.26,51.31 32.26,42.8 33.78,41.27 33.78,40.89 IC1.25
  Bottom 0.254: v38.48,57.53 38.48,61.34 IC2.D9
GND  (via drill 0.6)
  Top 0.254: 27.23,37.85 C5.2 28.57,38.42 29.14,37.85 IC1.31 | IC1.8 47.74,38.85 48.9,40.01 50.48,40.01 C3.2 | IC1.16 39.35,49.87 C6.2 | C4.2 33.66,49.84 33.66,46.04 35.35,44.34 IC1.24
  Top 0.305: C9.2 IC4.7 16.84,56.2 16.18,55.55 16.18,53.98 | IC4.26 IC4.25 18.79,47.68 C7.2 18.41,47.31 v18.41,45.72 | 16.18,53.98 IC4.21 | v15.24,45.72 14.92,46.04 C8.2 15.24,47.95 15.24,48.26 14.23,49.27 IC4.18 14.23,52.44 12.7,53.98 v12.06,53.98 | v15.88,53.98 16.18,53.98
  Top 0.508: 55.63,4.45 55.63,2.54 S2.3 | R2.1 66.04,2.29 63.37,2.29 63.25,2.41 S3.3 62.99,2.54 61.09,4.45 55.63,4.45 | R10.1 15.11,16.51 15.11,18.8 15.49,19.18 C16.- 15.37,19.43 15.37,20.7 11.68,24.38 11.68,31.11 11.18,31.62 C2.- 11.05,35.69 IC3.1 10.16,35.81 12.7,35.81 | R10.1 14.99,16.26 11.3,12.57 U$1.3 | C17.2 21.59,16.51 21.59,18.41 IC5.4 | 27.69,6.22 IC6.GND 26.63,5.08 25.4,5.08 21.59,8.89 21.59,16.26 C17.2 | R10.1 15.37,16.51 21.34,16.51 C17.2 | C10.2 C9.2 16.76,61.09 | 15.24,35.81 15.24,36.45 14.61,37.08 C1.- 15.37,36.58 17.14,38.35 26.67,38.35 C5.2 | 15.24,35.81 R1.1 | 12.7,35.81 15.24,35.81 | 12.7,35.81 12.7,45.72 | 39.12,50.42 39.12,50.16 C6.2 39.05,52.07 40.45,53.47 47.5,53.47 C11.2 47.62,53.72 52.7,53.72 C12.2 52.83,53.72 55.5,53.72 57.15,52.07 57.15,43.18 55.88,41.91 54.61,41.91 52.55,39.85 | 50.8,36.45 C13.1 51.05,36.45 52.45,36.45 | C3.2 50.8,40.26 52.13,40.26 52.55,39.85 | C14.2 59.69,29.59 | C14.2 59.56,29.72 | J1.4 J1.6 J1.8 J1.10 J1.12 J1.14 J1.16 J1.18 J1.20 66.04,25.4 64.77,24.13 62.23,24.13 60.96,25.4 60.96,26.67 59.69,27.94 C14.2 | S2.4 55.63,8.89 55.63,4.45 | S1.4 40.13,19.94 40.13,14.48 IC2.GND@0 IC2.GND@1 | v33.91,51.69 33.91,50.16 C4.2 | 52.45,36.45 53.98,34.92 53.98,33.97 58.1,29.84 59.38,29.84 C14.2 | 52.55,39.85 52.7,39.69 52.7,36.7 52.45,36.45
  Top 0.61: X1.GND 9.22,50.47 10.16,49.53 10.16,46.99 11.43,45.72 12.7,45.72 v15.24,45.72 | 16.76,61.09 16.76,62.48 17.78,63.5 19.68,63.5 20.95,62.23 20.95,61.59 22.86,59.69 25.4,59.69 26.67,60.96 IC2.GND@2
  Bottom 0.305: v15.24,45.72 v18.41,45.72 | v12.06,53.98 v15.88,53.98
  Bottom 0.508: 63.25,2.54 S3.3 63.25,2.79 63.25,8.89 S3.4 63.37,9.14 63.37,10.03 66.04,12.7 67.31,12.7 67.63,13.02 67.63,25.08 J1.20 | IC6.GND 27.81,6.22 32.38,6.22 40.13,13.97 IC2.GND@0 | S2.3 55.5,2.54 53.59,2.54 50.93,5.21 49.15,5.21 48.01,6.35 48.01,8.38 43.18,13.21 IC2.GND@1 | v33.91,51.69 33.91,54.99 IC2.GND@2
GREENLED  (via drill 0.6)
  Top 0.254: v43.56,41.27 43.18,40.89 42.42,40.89 IC1.12 | v46.74,25.91 45.47,25.91 43.94,27.43 41.4,27.43 v40.01,26.04 | v39.12,17.14 39.12,14.86 39.37,14.61 39.37,11.43 v41.66,9.14 | v44.2,6.6 44.2,6.99 44.58,7.37 44.58,8.76 45.72,9.91 R14.2
  Bottom 0.254: v43.56,41.27 43.56,39.75 46.35,36.96 46.35,27.56 46.74,27.18 v46.74,25.91 | v40.01,26.04 39.24,26.04 38.23,25.02 38.23,24 39.62,22.61 43.18,22.61 44.2,21.59 44.2,19.56 41.78,17.14 v39.12,17.14 | v44.2,6.6 v41.66,9.14
MIC
  Top 0.254: 26.8,20.95 27.43,20.95 32.13,25.65 33.02,25.65 39.88,32.51 39.88,33.78 IC1.46 | 26.8,20.95 26.8,19.68 IC5.6 | 26.8,20.95 IC5.7
MISO  (via drill 0.6)
  Top 0.254: v37.97,48.01 37.08,47.12 37.08,44.2 36.83,43.94 36.83,42.42 IC1.21 | v35.18,59.31 34.67,59.31 IC2.D12
  Bottom 0.254: v37.97,48.01 37.97,56.01 35.18,58.8 v35.18,59.31
MOSI  (via drill 0.6)
  Top 0.254: v36.58,41.02 36.32,41.27 36.32,42.29 IC1.22
  Bottom 0.254: v36.58,41.02 36.58,43.69 37.08,44.2 37.08,56.13 34.29,58.93 IC2.D11
N$1
  Top 0.305: IC4.22 16.84,53.03 17.78,53.98 21.59,53.98 22.86,52.7 LD3.C
N$2
  Top 0.305: IC4.16 12.94,52.47 12.54,52.87 X1.D-
N$3  (via drill 0.6)
  Top 0.254: v17.02,29.72 16.51,29.21 LD1.C | v16.76,32 15.24,32 R1.2
  Bottom 0.254: v17.02,29.72 17.02,31.75 v16.76,32
N$4
  Top 0.305: IC4.15 12.29,51.85 12.06,52.07 X1.D+
N$5
  Top 0.305: IC4.17 13.59,49.15 12.7,48.26 12.7,47.95 C8.1
N$6
  Top 0.305: IC4.23 17.48,52.41 18.41,53.34 20.95,53.34 21.59,52.7 21.59,49.53 20.95,48.9 LD4.C
N$7
  Top 0.305: R17.2 LD4.A
N$8
  Top 0.305: R16.2 LD3.A
N$9  (via drill 0.6)
  other vias: 1.91,41.27
N$10  (via drill 0.6)
  other vias: 3.81,41.27
N$11
  Top 0.254: IC1.9 46.97,39.35 52.7,45.09 Q1.2 C12.1
N$12
  Top 0.254: IC1.10 46.2,39.85 47.62,41.27 Q1.1 C11.1
N$13
  Top 0.254: IC1.6 47.24,37.85 48.26,36.83 48.26,34.92 49.53,33.66 50.65,33.66 C13.2
N$14  (via drill 0.6)
  other vias: 1.91,38.1
N$15  (via drill 0.6)
  other vias: 1.91,34.29
N$16
  Top 0.254: R2.2 LD2.A
N$17  (via drill 0.6)
  other vias: 3.81,34.29
N$18  (via drill 0.6)
  Top 0.254: 22.1,22.35 21.97,22.23 IC5.1 22.1,22.35 | 22.23,26.29 R7.2 | 22.1,22.35 v24,22.35 | v24.77,18.41 IC5.5
  Top 0.305: 22.23,26.29 23.24,26.29 24.13,25.4 24.13,22.48 v24,22.35
  Bottom 0.254: v24,22.35 v24.77,18.41
N$19
  Top 0.254: R8.2 18.92,24.51 22.23,24.51 R7.1 | 20.83,20.95 IC5.2
  Top 0.305: 18.92,24.51 18.92,21.72 19.68,20.95 20.83,20.95
N$20
  Top 0.254: R12.1 10.29,24.13 6.35,24.13 5.59,24.89 C15.+ 5.59,24.77 U2.1
N$21  (via drill 0.6)
  Top 0.254: R10.2 13.08,16.51 13.08,18.54 12.45,19.18 C16.+ 12.32,19.3 11.56,20.07 6.99,20.07 R11.1 6.86,20.19 3.94,20.19 1.91,22.23 U2.2 | 14.1,24.64 13.59,24.64 13.46,24.77 R9.1 14.1,24.64 | 14.1,24.64 16.89,24.64 R8.1 | v14.1,23.37 14.1,24.64
  Bottom 0.254: v14.1,23.37 3.05,23.37 1.91,22.23 U2.2
N$22  (via drill 0.6)
  Top 0.254: v14.99,26.8 13.46,26.8 R9.2 | v7.49,26.8 6.73,26.8 5.59,27.94 C15.- | 20.83,19.68 IC5.3
  Top 0.305: 20.83,19.68 18.41,19.68 17.78,20.32 17.78,21.46 v17.4,21.84
  Bottom 0.254: v7.49,26.8 13.72,26.8 | 13.72,26.8 v14.99,26.8 | 13.72,26.8 v17.4,21.84
N$23  (via drill 0.6)
  Top 0.254: v34.04,3.68 32.51,5.21 U1.R | v46.99,4.45 47.5,4.45 48.26,3.68 LD7.C R13.1
  Bottom 0.254: v34.04,3.68 46.23,3.68 v46.99,4.45
N$24  (via drill 0.6)
  other vias: 5.71,34.29
N$25  (via drill 0.6)
  Top 0.254: v32.51,3.81 31.11,2.41 U1.B | v44.45,4.57 44.7,4.57 45.72,3.56 LD6.C R14.1
  Bottom 0.254: v32.51,3.81 32.89,3.81 33.66,4.57 v44.45,4.57
N$26  (via drill 0.6)
  other vias: 5.71,41.27
N$27
  Top 0.254: U1.G 32.51,2.41 36.32,2.41 39.62,5.71 39.62,7.49 40.26,8.13 43.05,8.13 43.18,8 R15.1 LD5.C
N$28
  Top 0.508: X1.VBUS 6.04,53.67 3.49,51.12 3.49,49.85 5.08,48.26 5.08,43.95
  Top 0.61: F1.2 5.08,43.95
N$29  (via drill 0.6 pad 3.81)
  other vias: 3.81,60.96
N$30  (via drill 0.6 pad 3.81)
  other vias: 3.81,15.24
N$31  (via drill 0.6 pad 3.81)
  other vias: 64.77,20.32
N$32  (via drill 0.6 pad 3.81)
  other vias: 64.77,55.88
N$33  (via drill 0.6)
  Top 0.254: v15.24,8.89 15.24,6.35 13.97,5.08 10.16,5.08 8.89,3.81 JP2.1
  Bottom 0.254: v15.24,8.89 16.51,8.89 18.03,7.37 25.78,7.37 IC6.VOUT
N$34
  Top 0.254: JP2.3 11.68,8.89 15.24,12.45 U$1.2
N$35
  Top 0.508: LD7.A 48.26,1.52 45.85,1.52 LD6.A 45.72,1.52 43.18,1.52 LD5.A 43.05,1.65 40.64,4.06 JP1.1
N$36
  Top 0.508: JP1.3 35.43,6.48 32,6.48 31.11,5.59 31.11,5.33 U1.A
NRST  (via drill 0.6)
  Top 0.254: 33.27,16.51 33.27,14.22 IC2.RES | J1.15 63.25,31.5 59.69,31.5 C14.1 | v45.09,36.96 44.7,37.34 42.42,37.34 IC1.5 | v31.11,32.13 31.11,29.34 v32,28.45 | v55.5,27.69 52.58,27.69 46.74,21.84 43.94,21.84 42.67,23.11 34.92,23.11 33.66,24.38 S1.1 34.16,23.75 31.62,21.21 31.62,19.56 33.27,17.91 33.27,16.51 | 33.27,16.51 R6.2
  Bottom 0.254: v45.09,36.96 44.58,36.96 42.8,38.73 36.07,38.73 31.11,33.78 v31.11,32.13 | v32,28.45 32.51,28.45 33.78,27.18 33.78,24.64 33.66,24.51 S1.1 | J1.15 62.23,31.75 58.17,27.69 v55.5,27.69
REDLED  (via drill 0.6)
  Top 0.254: v44.45,50.16 40.89,46.61 40.89,42.42 IC1.13 | v52.96,20.19 52.45,20.19 49.78,17.53 42.16,17.53 41.66,17.02 41.66,16.26 42.67,15.24 43.81,15.24 44.45,14.61 44.45,13.34 43.81,12.7 40.77,12.7 v40.39,12.32 | v46.99,6.73 46.99,8.64 48.26,9.91 R13.2
  Bottom 0.254: v44.45,50.16 44.45,62.87 45.4,63.82 56.2,63.82 57.15,62.87 57.15,57.91 64.64,50.42 64.64,31.24 63.75,30.35 62.99,30.35 52.96,20.32 v52.96,20.19 | v40.39,12.32 41.4,12.32 v46.99,6.73
RX  (via drill 0.6)
  Top 0.254: IC4.1 20.83,58.17 20.95,58.17 20.95,56.52 24.13,53.34 24.13,48.26 25.4,46.99 25.4,45.72 26.42,44.7 v29.21,44.7 | v34.04,43.69 34.04,42.55 35.31,41.27 35.31,41.02 36.2,40.13 38.35,40.13 38.86,40.64 38.86,42.29 IC1.17
  Bottom 0.254: v34.04,43.69 29.97,43.69 29.21,44.45 v29.21,44.7
S2  (via drill 0.6)
  Top 0.254: 51.18,2.54 S2.1 51.18,2.67 51.18,8.89 S2.2 | v28.83,31.5 33.15,35.81 33.78,35.81 IC1.35
  Bottom 0.254: v28.83,31.5 28.83,21.59 34.67,15.75 45.85,15.75 48.51,13.08 48.51,10.92 50.42,9.02 51.05,9.02 S2.2
S3  (via drill 0.6)
  Top 0.254: v46.61,46.48 35.43,35.31 33.91,35.31 IC1.36 | S3.2 58.8,9.02 60.45,9.02 67.63,16.19 67.63,51.75 67.31,52.07 62.23,52.07 59.31,54.99 v46.61,54.99
  Bottom 0.254: 58.67,2.67 S3.1 58.67,2.79 58.67,8.89 S3.2 | v46.61,54.99 v46.61,46.48
SCK  (via drill 0.6)
  Top 0.254: v36.2,53.98 36.96,53.21 36.96,50.29 38.86,48.39 38.86,43.94 37.85,42.93 37.85,42.42 IC1.19
  Bottom 0.254: v36.2,53.98 36.2,55.24 IC2.D13
SENSOR_LED  (via drill 0.6)
  Top 0.254: v33.15,44.58 33.15,42.67 34.8,41.02 34.8,40.64 34.54,40.39 33.91,40.39 IC1.26 | v57.66,7.11 63.88,7.11 66.04,9.27 LD2.C
  Bottom 0.254: v33.15,44.58 31.88,44.58 28.7,47.75 27.94,47.75 27.43,47.24 27.43,22.23 34.42,15.24 43.81,15.24 44.45,14.61 44.45,13.21 50.55,7.11 v57.66,7.11
TCK  (via drill 0.6)
  Top 0.254: v34.67,28.57 34.67,29.84 35.81,30.99 36.32,30.99 36.83,31.5 36.83,33.78 IC1.40 | v42.8,21.72 43.31,21.72 43.69,21.34 47.5,21.34 v52.96,26.8
  Bottom 0.254: v34.67,28.57 34.67,28.07 37.72,25.02 37.72,23.75 39.75,21.72 v42.8,21.72 | v52.96,26.8 52.96,29.15 55.56,31.75 56.2,31.75 57.15,32.7 57.15,36.83 59.69,39.37 J1.9
TDI  (via drill 0.6)
  Top 0.254: v34.16,32.38 35.69,32.38 35.81,32.51 35.81,33.78 IC1.38 | v33.15,21.46 41.78,21.46 42.42,20.83 50.04,20.83 53.34,24.13 v53.34,24.64 | v61.02,35.75 60.96,35.81 60.96,43.18 62.23,44.45 J1.5
  Bottom 0.254: v34.16,32.38 33.4,32.38 30.73,29.72 30.73,23.88 v33.15,21.46 | v61.02,35.75 60.96,35.69 60.96,34.29 56.2,29.53 54.93,29.53 54.29,28.89 54.29,25.59 v53.34,24.64
TDO  (via drill 0.6)
  Top 0.254: v32.89,26.8 32.89,32.38 34.29,33.78 35.31,33.78 IC1.37 | v42.16,18.8 50.29,18.8 53.47,21.97 54.48,21.97 57.91,25.4 v57.91,28.7
  Bottom 0.254: v32.89,26.8 32.89,26.16 31.62,24.89 31.62,24.13 33.4,22.35 35.31,22.35 38.86,18.8 v42.16,18.8 | v57.91,28.7 J1.13
TEMP  (via drill 0.6)
  Top 0.254: v38.73,32.64 39.37,33.27 39.37,33.78 IC1.45 | v45.85,24.26 v43.56,26.54 | v52.58,11.3 51.05,11.3 49.66,9.91 v49.66,4.19
  Bottom 0.254: v38.73,32.64 38.73,31.37 v43.56,26.54 | v45.85,24.26 45.85,23.75 54.61,14.99 54.61,13.34 v52.58,11.3 | v49.66,4.19 48.01,4.19 46.35,2.54 24.13,2.54 20.32,6.35 JP2.2
TMS  (via drill 0.6)
  Top 0.254: v35.05,31.5 36.07,31.5 36.32,31.75 36.32,33.78 IC1.39 | v36.7,27.3 37.59,26.42 38.35,26.42 38.86,26.92 38.86,27.43 39.37,27.94 39.37,28.96 41.02,30.61 41.78,30.61 42.8,31.62 44.83,31.62 45.34,32.13 48.77,32.13 v49.15,32.51
  Bottom 0.254: v35.05,31.5 35.05,29.46 36.7,27.81 v36.7,27.3 | J1.7 60.96,41.91 54.29,35.24 54.29,33.66 53.02,32.38 49.28,32.38 v49.15,32.51
TX  (via drill 0.6)
  Top 0.254: v37.97,41.02 38.35,41.4 38.35,42.29 IC1.18
  Top 0.305: IC4.5 18.14,57.12 v17.78,56.77
  Bottom 0.254: 22.86,56.9 17.91,56.9 v17.78,56.77 | 22.86,56.9 v23.37,56.9 | v37.97,41.02 37.97,43.05 39.37,44.45 39.37,60.33 40.64,61.59 40.64,62.87 39.69,63.82 23.18,63.82 22.54,63.18 22.54,57.47 22.86,57.15 22.86,56.9
U1RX
  Top 0.254: IC2.RX 63.5,59.69 62.23,58.42 38.1,58.42 31.75,52.07 31.75,40.64 32.54,39.85 IC1.27
U1TX
  Top 0.254: IC2.TX 60.96,60.96 59.69,59.69 38.1,59.69 30.48,52.07 30.48,40.64 31.77,39.35 IC1.28
(copper drawn outside any net)
  shapes: Bottom area x1, Top area x1

### Text on the board
tPlace: Stellaris | Guru | CEDT | NSIT | C:/Users/dvg/Documents/ARMBook/TIProjects/Guru/V9/TI Logo.bmp
bPlace: , NSIT | CEDT